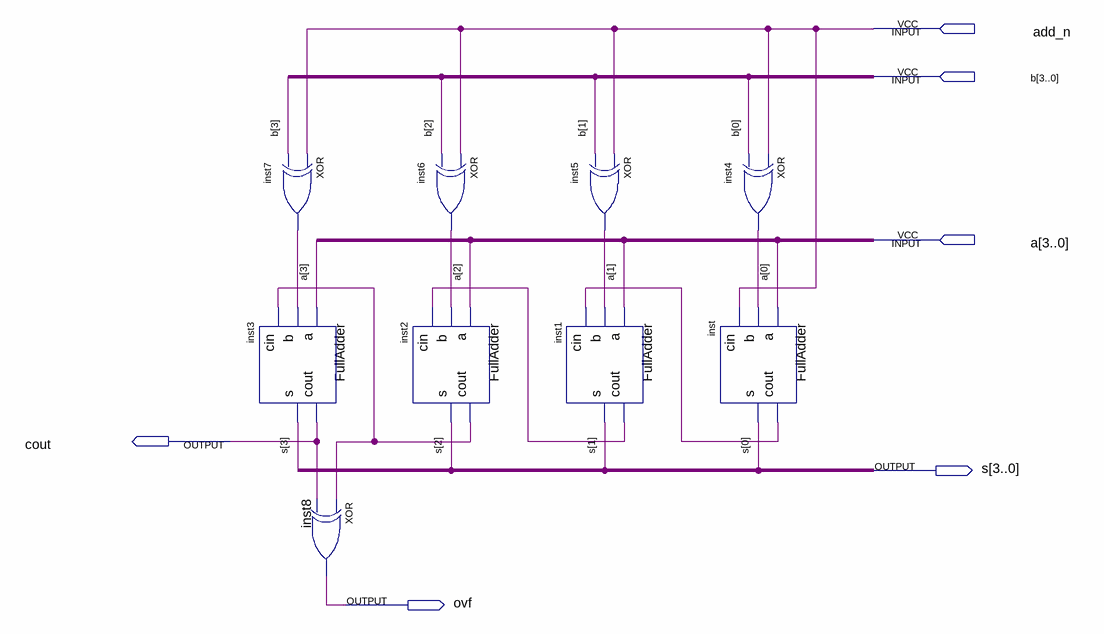
[diagram p0: schematic sheet]
// Quartus schematic AddSub4.bdf as structural Verilog: 9 symbols, 6 pins
module AddSub4 (
  input  add_n,
  input  [3:0] b,
  input  [3:0] a,
  output cout,
  output [3:0] s,
  output ovf
);

  wire inst1_cout, inst2_cout, inst4_out, inst5_out, inst6_out, inst7_out, inst_cout;

  xor inst7 (inst7_out, add_n, b[3]);
  FullAdder inst3 (.a(a[3]), .b(inst7_out), .cin(inst2_cout), .cout(cout), .s(s[3]));
  xor inst8 (ovf, inst2_cout, cout);
  xor inst6 (inst6_out, add_n, b[2]);
  FullAdder inst2 (.a(a[2]), .b(inst6_out), .cin(inst1_cout), .cout(inst2_cout), .s(s[2]));
  xor inst5 (inst5_out, add_n, b[1]);
  FullAdder inst1 (.a(a[1]), .b(inst5_out), .cin(inst_cout), .cout(inst1_cout), .s(s[1]));
  xor inst4 (inst4_out, add_n, b[0]);
  FullAdder inst (.a(a[0]), .b(inst4_out), .cin(add_n), .cout(inst_cout), .s(s[0]));
endmodule
